# EAGLE design H08R7 (EAGLE 9.6.1)

## Sheet 1 of 2
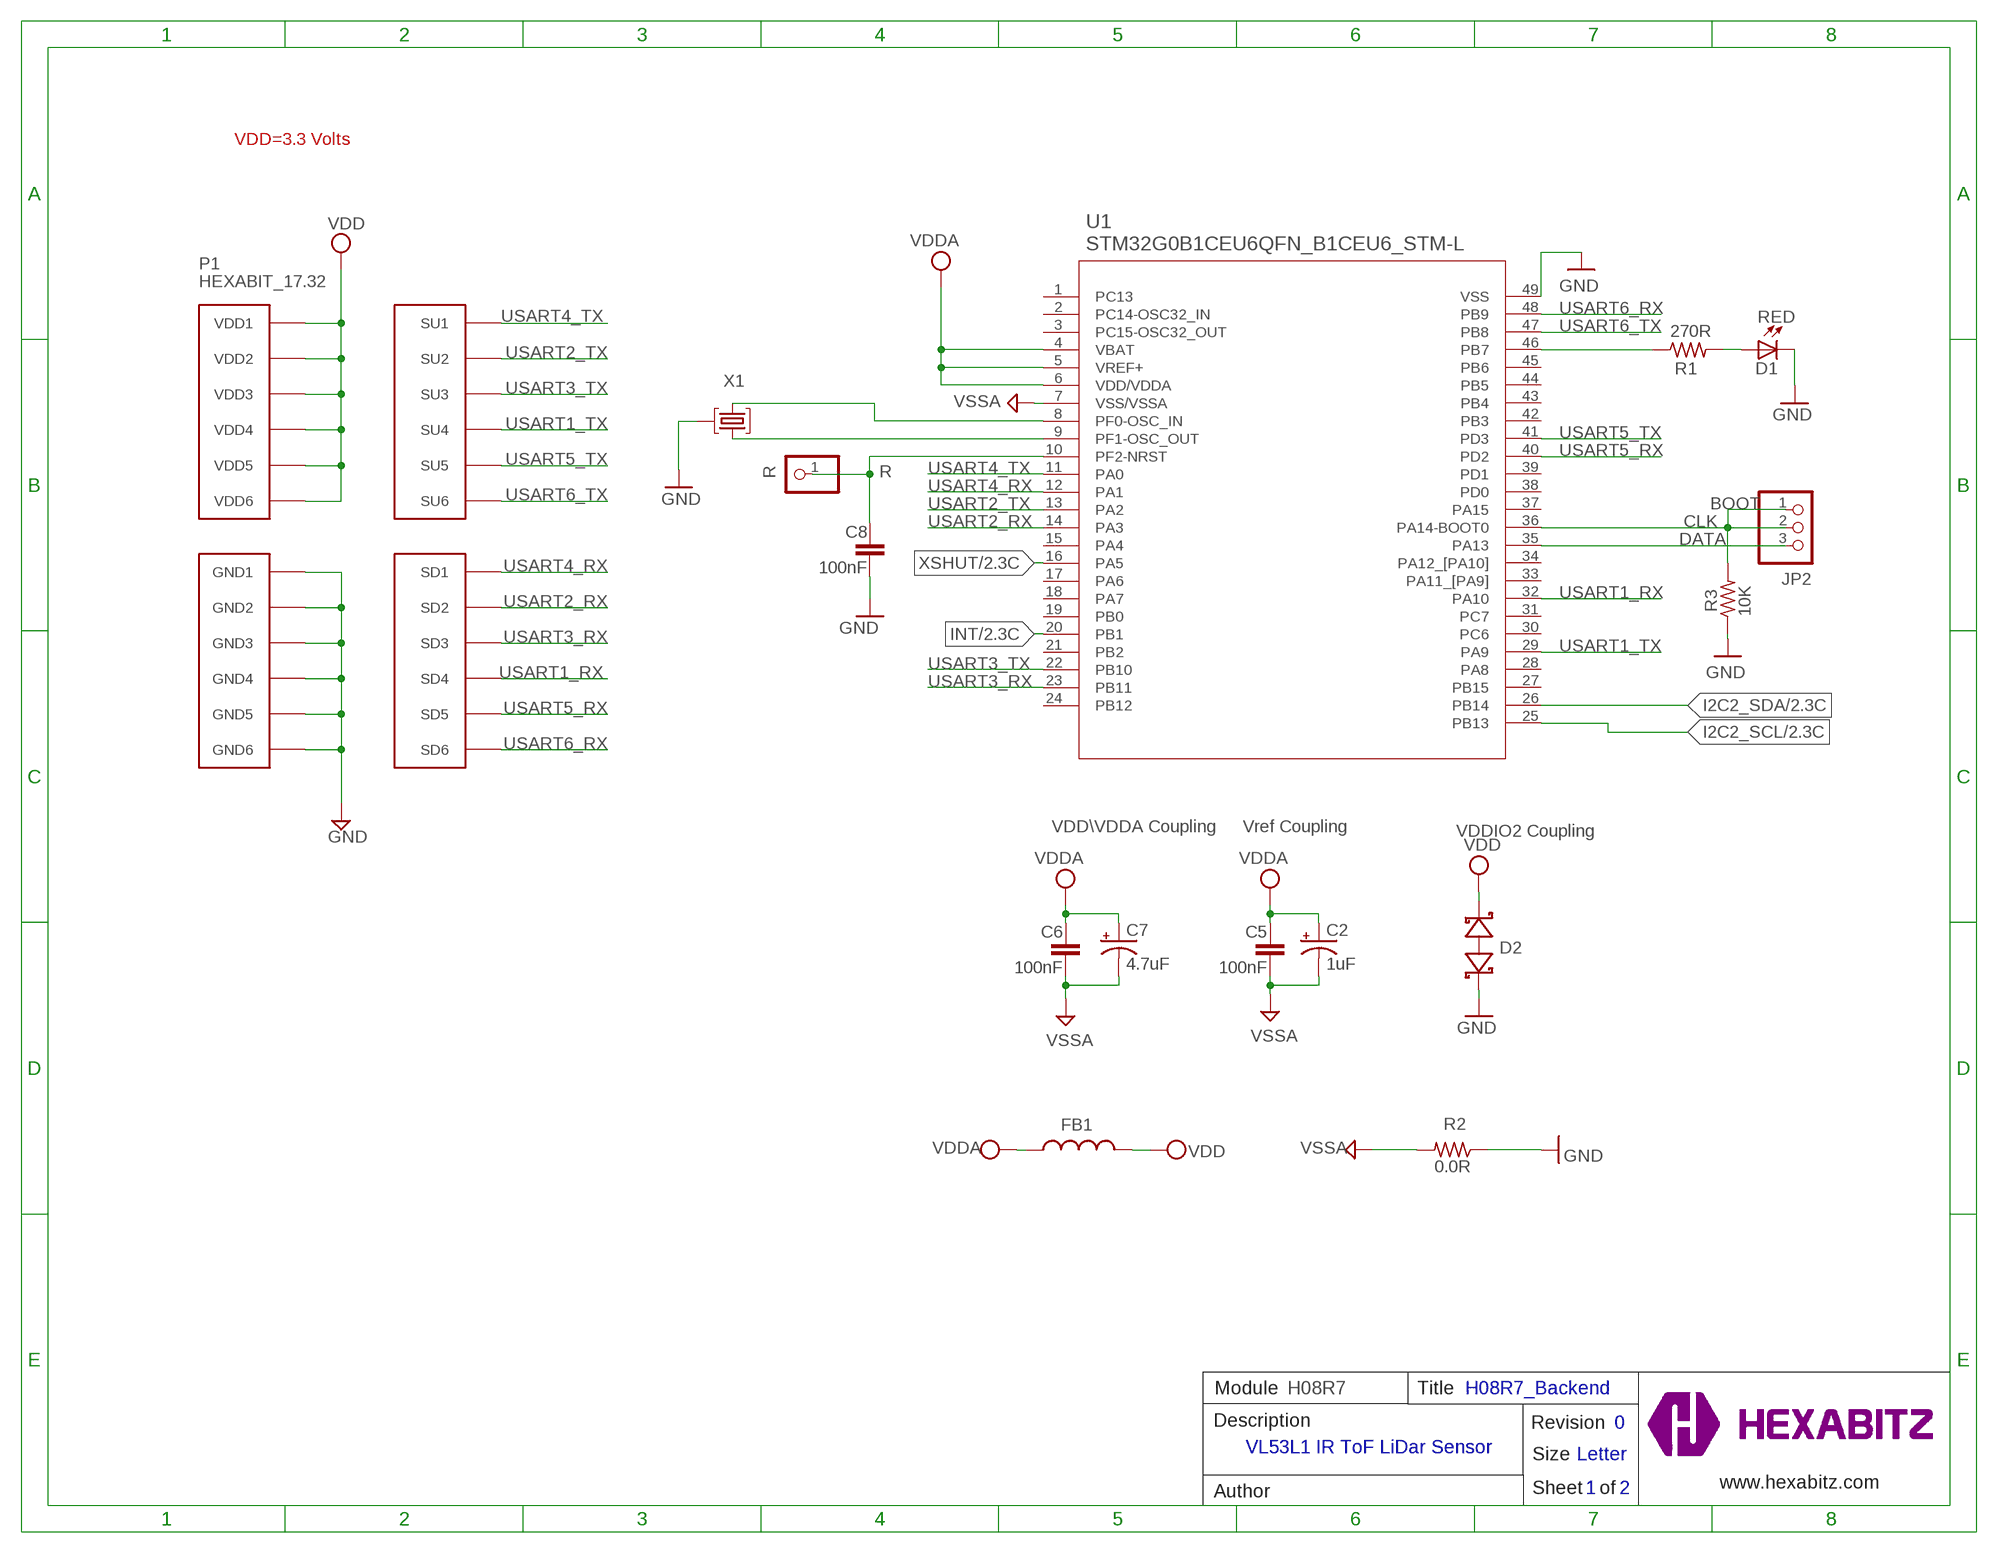
[diagram p0: schematic, sheet 1]

### Parts
C2  1uF  C-0805-POL  [C-0805-POL]
C5  100nF  C-0603  [C-0603]
C6  100nF  C-0603  [C-0603]
C7  4.7uF  C-0805-POL  [C-0805-POL]
C8  100nF  C-0603  [C-0603]
D1  RED  VLMS1300-GS08  [VLMS1300-GS08]
D2  BOURNS_CDSOD323-T03SCBOURNS_CDSOD323-T03SC_0_0  [BOURNS_CDSOD323-T03SC_0]
FB1  FB-TDK_MMZ1608Y300B  [FB-TDK_MMZ1608Y300B]
JP2  PINHD-1X3  [1X03]
P1  HEXABIT_17.32  [HEXABIT_17.32]
R  R  PINHD-1X1  [1X01]
R1  270R  R-0603  [R-0603]
R2  0.0R  R-0603  [R-0603]
R3  10K  R-0603  [R-0603]
TRIMBLE-LOGO1  HEXA-LOGO  [HEXA-LOGO]
U1  STM32G0B1CEU6QFN_B1CEU6_STM-L  [QFN_B1CEU6_STM-L]
X1  XTALL_CSTCE8M00G52  [XTALL_CSTCE8M00G52]

### Nets
CLK: JP2.1 JP2.2 R3.2 U1.36(PA14-BOOT0)
DATA: JP2.3 U1.35(PA13)
GND: C8.2 D1.C D2.1(A) P1.PAD_PD7(GND1) P1.PAD_PD8(GND2) P1.PAD_PD9(GND3) P1.PAD_PD10(GND4) P1.PAD_PD11(GND5) P1.PAD_PD12(GND6) R2.1 R3.1 U1.49(VSS) X1.P$2 ; also sheet 2
I2C2_SCL: U1.25(PB13) ; also sheet 2
I2C2_SDA: U1.26(PB14) ; also sheet 2
INT: U1.20(PB1) ; also sheet 2
N$3: D1.A R1.2
N$4: C8.1 R.1 U1.10(PF2-NRST)
N$5: U1.9(PF1-OSC_OUT) X1.P$1
N$6: U1.8(PF0-OSC_IN) X1.P$3
N$7: R1.1 U1.46(PB7)
USART1_RX: P1.PAD_PD4(SD4) U1.32(PA10)
USART1_TX: P1.PAD_PU4(SU4) U1.29(PA9)
USART2_RX: P1.PAD_PD2(SD2) U1.14(PA3)
USART2_TX: P1.PAD_PU2(SU2) U1.13(PA2)
USART3_RX: P1.PAD_PD3(SD3) U1.23(PB11)
USART3_TX: P1.PAD_PU3(SU3) U1.22(PB10)
USART4_RX: P1.PAD_PD1(SD1) U1.12(PA1)
USART4_TX: P1.PAD_PU1(SU1) U1.11(PA0)
USART5_RX: P1.PAD_PD5(SD5) U1.40(PD2)
USART5_TX: P1.PAD_PU5(SU5) U1.41(PD3)
USART6_RX: P1.PAD_PD6(SD6) U1.48(PB9)
USART6_TX: P1.PAD_PU6(SU6) U1.47(PB8)
VDD: D2.2(C) FB1.2 P1.PAD_PU7(VDD1) P1.PAD_PU8(VDD2) P1.PAD_PU9(VDD3) P1.PAD_PU10(VDD4) P1.PAD_PU11(VDD5) P1.PAD_PU12(VDD6) ; also sheet 2
VDDA: C2.1(+) C5.1 C6.1 C7.1(+) FB1.1 U1.4(VBAT) U1.5(VREF+) U1.6(VDD/VDDA)
VSSA: C2.2(-) C5.2 C6.2 C7.2(-) R2.2 U1.7(VSS/VSSA)
XSHUT: U1.16(PA5) ; also sheet 2
Unconnected: U1.1(PC13) U1.2(PC14-OSC32_IN) U1.3(PC15-OSC32_OUT) U1.15(PA4) U1.17(PA6) U1.18(PA7) U1.19(PB0) U1.21(PB2) U1.24(PB12) U1.27(PB15) U1.28(PA8) U1.30(PC6) U1.31(PC7) U1.33(PA11_[PA9]) U1.34(PA12_[PA10]) U1.37(PA15) U1.38(PD0) U1.39(PD1) U1.42(PB3) U1.43(PB4) U1.44(PB5) U1.45(PB6)

### Notes on the sheet
- VDD=3.3 Volts
- BOOT
- VDD\VDDA Coupling | Vref Coupling | VDDIO2 Coupling
- Module | H08R7 | Title | H08R7_Backend
- Description | Revision | 0
- VL53L1 IR ToF LiDar Sensor
- Size | Letter
- www.hexabitz.com
- Author | Sheet   of | 1 | 2
- C:/Users/Admin/Desktop/logodraft.bmp

## Sheet 2 of 2
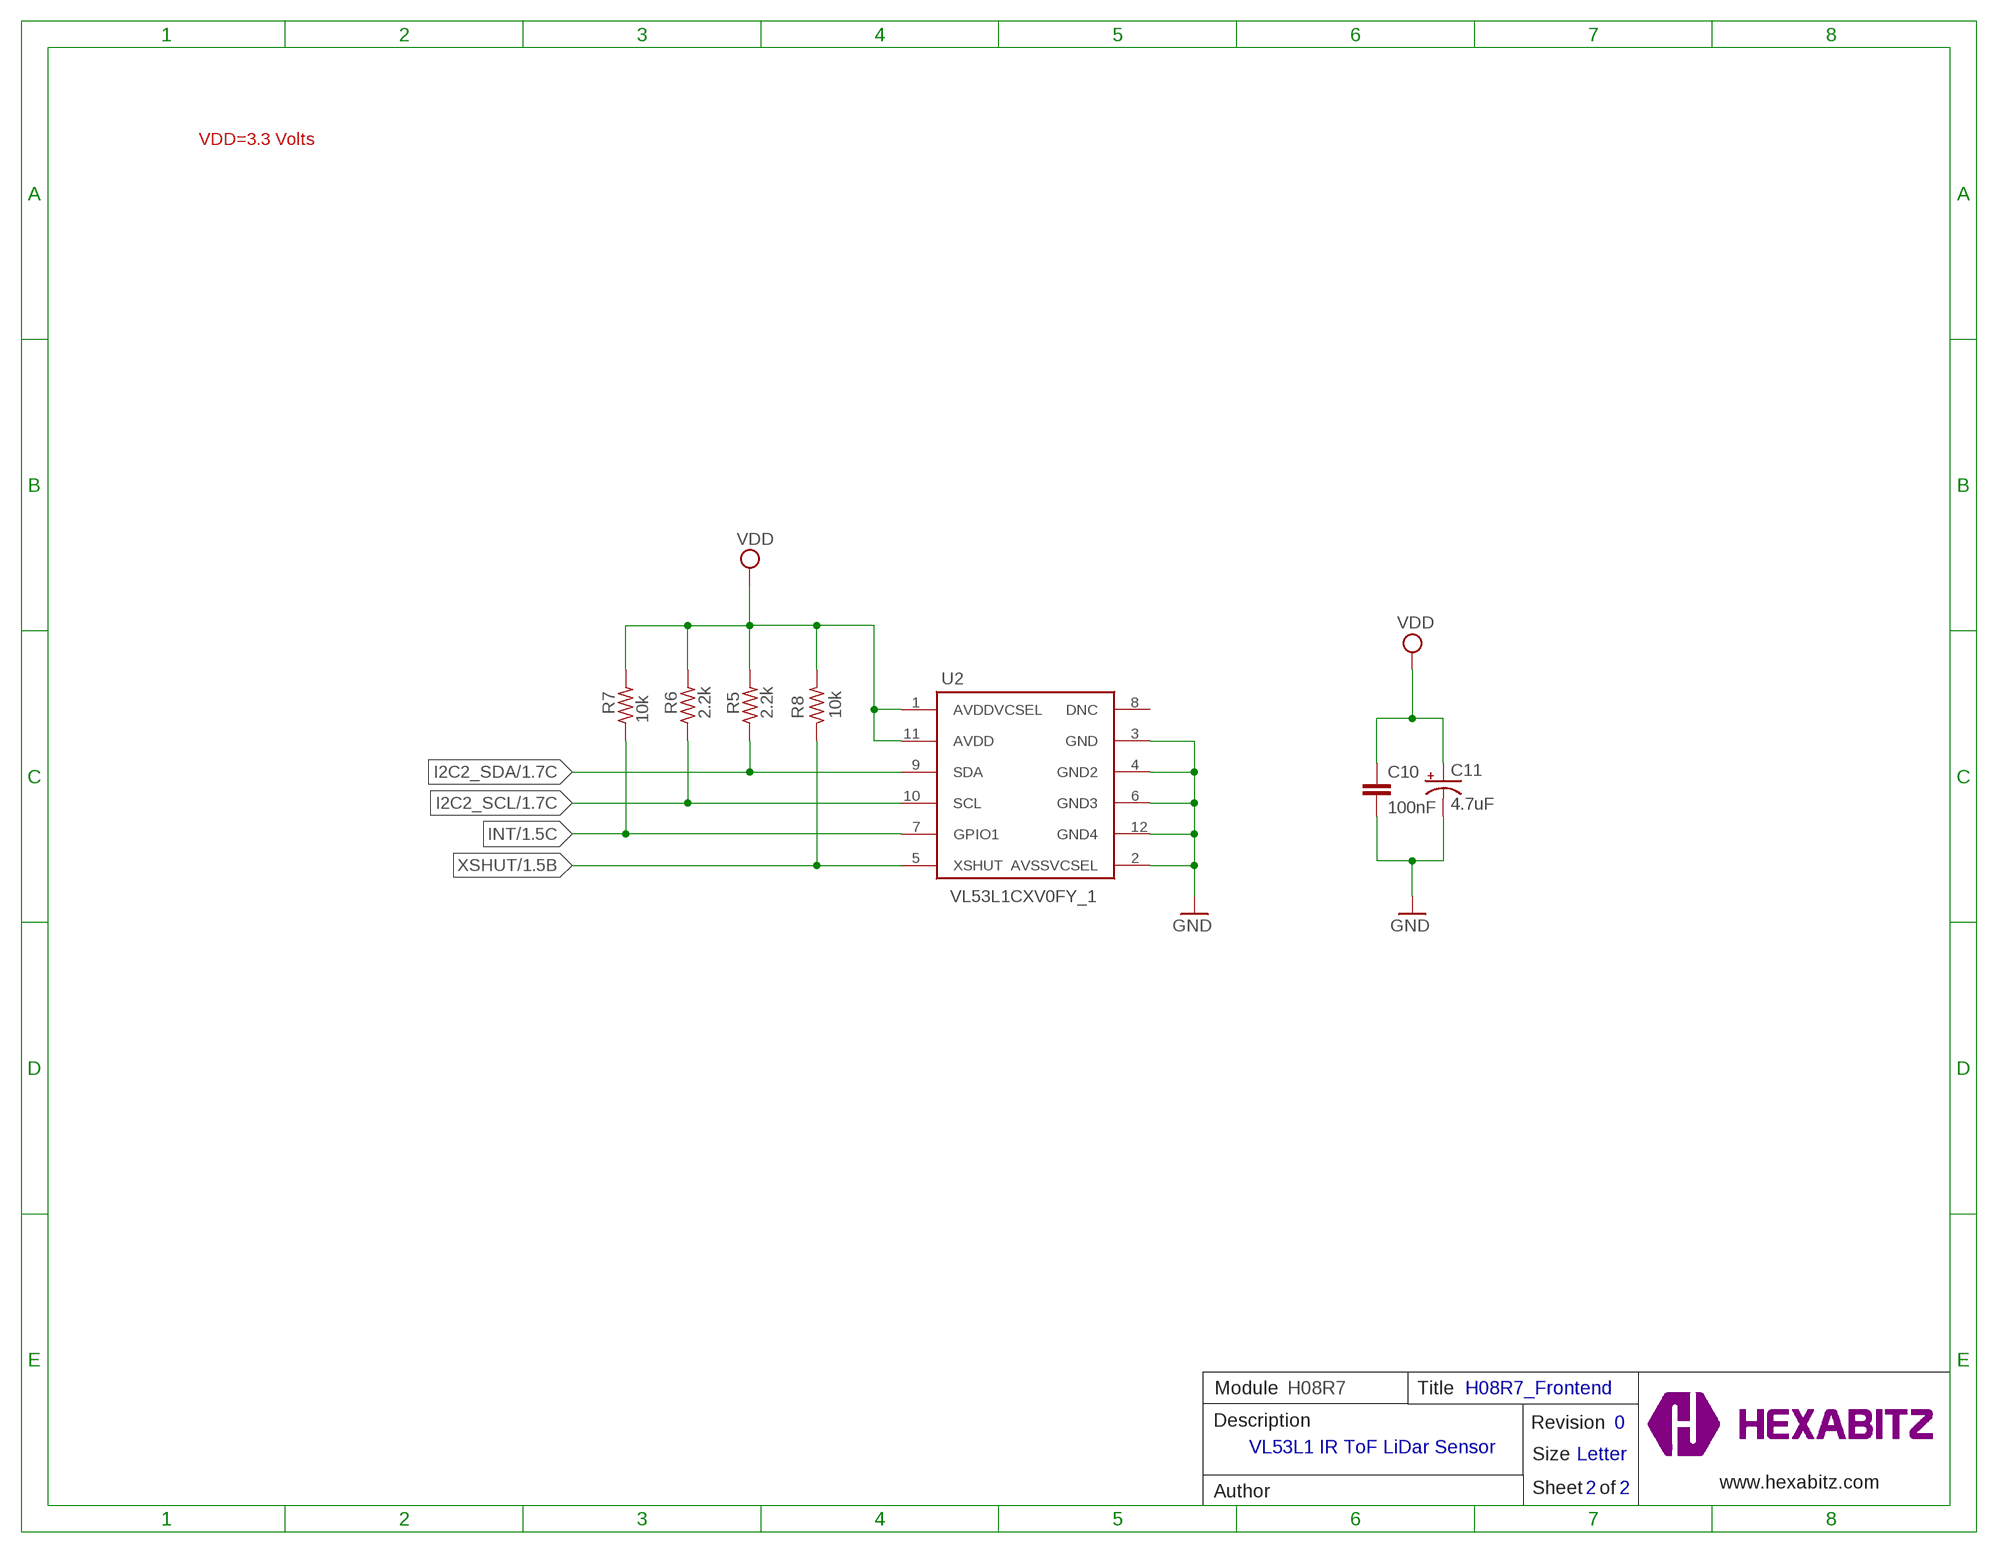
[diagram p1: schematic, sheet 2]

### Parts
C10  100nF  C-0603  [C-0603]
C11  4.7uF  C-0805-POL  [C-0805-POL]
R5  2.2k  R-0603  [R-0603]
R6  2.2k  R-0603  [R-0603]
R7  10k  R-0603  [R-0603]
R8  10k  R-0603  [R-0603]
U2  VL53L1CXV0FY_1  [VL53L1CXV0FY1]

### Nets
GND: C10.2 C11.2(-) U2.2(AVSSVCSEL) U2.3(GND) U2.4(GND2) U2.6(GND3) U2.12(GND4) ; also sheet 1
I2C2_SCL: R6.1 U2.10(SCL) ; also sheet 1
I2C2_SDA: R5.1 U2.9(SDA) ; also sheet 1
INT: R7.1 U2.7(GPIO1) ; also sheet 1
VDD: C10.1 C11.1(+) R5.2 R6.2 R7.2 R8.2 U2.1(AVDDVCSEL) U2.11(AVDD) ; also sheet 1
XSHUT: R8.1 U2.5(XSHUT) ; also sheet 1
Unconnected: U2.8(DNC)

### Notes on the sheet
- VDD=3.3 Volts
- Module | H08R7 | Title | H08R7_Frontend
- Description | Revision | 0
- VL53L1 IR ToF LiDar Sensor
- Size | Letter
- www.hexabitz.com
- Author | Sheet   of | 2 | 2

## Library data of the parts
C2 C7 C11 = HEXABITZ_RCLS:C-0805-POL: Cap Tant Solid SMD 2012
C5 C6 C8 C10 = HEXABITZ_RCLS:C-0603: CAP CER 10% X7R 0603
D1 = Hexabitz:VLMS1300-GS08: Red 0603 130° Clear 54 mcd 2 V Surface Mount ChipLED ; Octopart Url : http://octopart.com/vlms1300-gs08-vishay-21709201; MFN: Vishay; MPN: VLMS1300-GS08; OCTOPART_URL: https://octopart.com/vlms1300-gs08-vishay-21709201?r=sp&s=_gcP4_q8T1SC6PJQPTQ9yA
D2 = HEXABITZ_RCLS:BOURNS_CDSOD323-T03SC: CDSOD323-TxxSC - TVS Diode Series; DESCRIPTION: Dio Tvs Vwm 03V 500W Bidir Sod323 / Tape & Reel - 7" Reel; MFN: Bourns; MPN: CDSOD323-T03SC; OCTOPART_URL: https://octopart.com/cdsod323-t03sc-bourns-10487153?r=sp
FB1 = HEXABITZ_RCLS:FB-TDK_MMZ1608Y300B: Ferrite Beads Multi-Layer 30Ohm 25% 100MHz 1.5A 50mOhm DCR 0603; MFN: TDK; MPN: MMZ1608Y300B; OCTOPART_URL: https://octopart.com/mmz1608y300b-tdk-368280?r=sp&s=cd9_2ZEqQ9q9UNBuQgHAiA
JP2 = pinhead:PINHD-1X3: PIN HEADER
P1 = hexabitz_connectors:HEXABIT_?: Hexabitz Hexagon Module Connector Hexagon side length = 28.87mm.
R = HEXABITZ_USER_INTERFACE_PARTS:PINHD-1X1: PIN HEADER; MFN: TE Connectivity; MPN: 87227-1; OCTOPART_URL: https://octopart.com/87227-1-te+connectivity-39512052?r=sp
R1 R3 R5-R8 = HEXABITZ_RCLS:R-0603: Thick Film Resistors - SMD 0603
R2 = HEXABITZ_RCLS:R-0603: Thick Film Resistors - SMD 0603; MFN: Yageo; MPN: RC0603JR-070RL; OCTOPART_URL: https://octopart.com/rc0603jr-070rl-yageo-1241539?r=sp&s=X2NteqRjRNWrnx42Y0aliA; RESISTANCE: 0.0 Ohm
TRIMBLE-LOGO1 = HEXABITZ_USER_INTERFACE_PARTS:HEXA-LOGO: Trimble-Logo
U1 = HEXABITZ_ICs:STM32G0B1CEU6; COPYRIGHT: Copyright (C) 2021 Ultra Librarian. All rights reserved.; MANUFACTURER_PART_NUMBER: STM32G0B1CEU6; MFR_NAME: STMicroelectronics
U2 = HEXABITZ_ICs:VL53L1CXV0FY_1: Long distance ranging Time-of-Flight sen Source: Datasheet <https://componentsearchengine.com/Datasheets/1/VL53L1CXV0FY_1.pdf>; DESCRIPTION: Long distance ranging Time-of-Flight sen; HEIGHT: 1mm; MANUFACTURER_NAME: STMicroelectronics; MANUFACTURER_PART_NUMBER: VL53L1CXV0FY/1; MOUSER_PART_NUMBER: 511-VL53L1CXV0FY/1; MOUSER_PRICE-STOCK: https://www.mouser.co.uk/ProductDetail/STMicroelectronics/VL53L1CXV0FY-1?qs=W0yvOO0ixfFQE5v5L6h6PA%3D%3D
X1 = Hexabitz:XTALL_CSTCE8M00G52: MURATA CSTCE8M00G52-R0 RESONATOR, SMD, 8MHZ ; Octopart Url : https://octopart.com/cstce8m00g52-r0-murata-7145559; MFN: Murata; MPN: CSTCE8M00G52Z-R0; OCTOPART_URL: https://octopart.com/cstce8m00g52z-r0-murata-17755941?r=sp&s=JDnNJnrHQhyS8Zk4ofFWXw

## Board
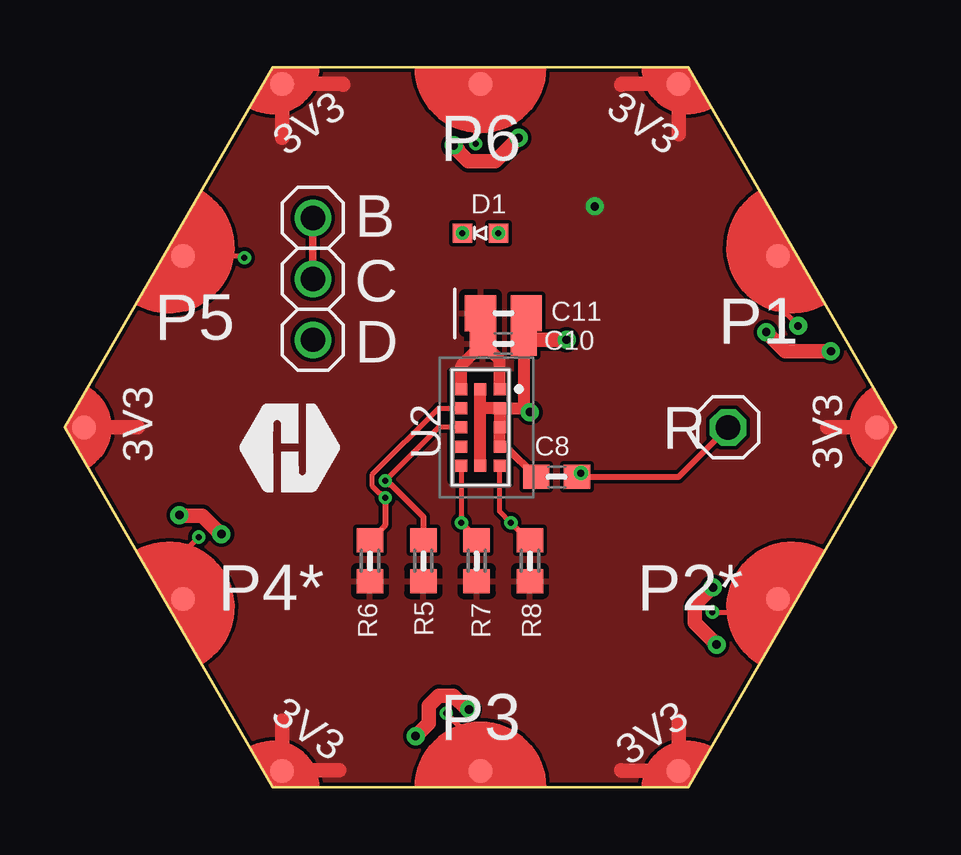
[diagram p2: board, top side]
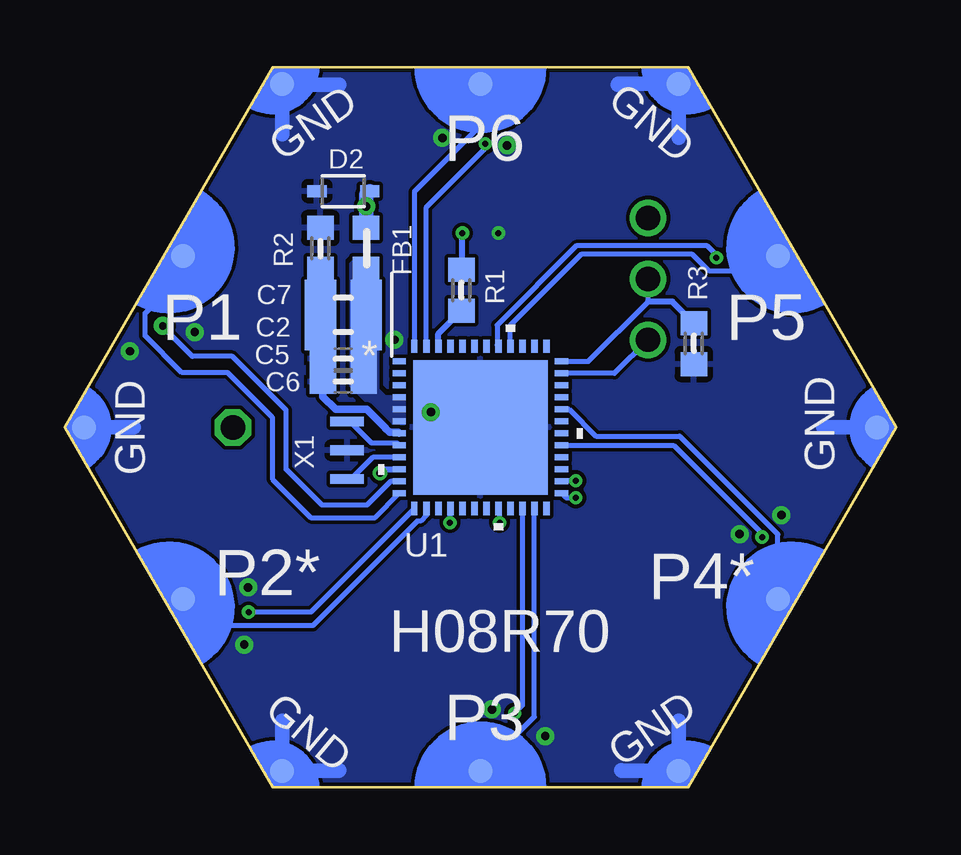
[diagram p3: board, bottom side, seen from below]

Size 34.64 x 30 mm. Coordinates in mm from the lower left corner, seen from the top.
Copper layers (1*16): Top 0.035mm / dielectric 1.5mm / Bottom 0.035mm
Design rules "default *": minimum track width 6mil, minimum drill 0.25mm, track to track 6mil, track to pad 6mil, pad to pad 6mil, via to via 6mil, smd to smd 0mil, copper to edge 0.15mm, drill to drill 1mil, minimum pad ring 10mil, minimum via ring 6mil, stop-mask expansion 4mil, vias tented up to drill 25mil, thermal gap 10mil

### Footprints (pad centres in the part's own frame; a part is rotated, then mirrored left to right if it is on the bottom)
C-0805-POL = smd 1.3 x 1.5: 1 -0.95,0; 2 0.95,0
C-0603 = smd 1.1 x 1: 1 -0.85,0; 2 0.85,0
VLMS1300-GS08 = smd 0.8 x 0.8: A 0,0.75; C 0,-0.75
BOURNS_CDSOD323-T03SC_0 = smd 0.8 x 0.5: 1 -1.1,0; 2 1.1,0
FB-TDK_MMZ1608Y300B = smd 1 x 1.1: 1 -0.85,0; 2 0.85,0
1X03 = drill 1.016: 1 -2.54,0; 2 0,0; 3 2.54,0
HEXABIT_17.32 = smd 1 x 1 bottom: PAD_PD1 12.39,7.15; PAD_PD2 12.39,-7.15; PAD_PD3 0,-14.31; PAD_PD4 -12.39,-7.15; PAD_PD5 -12.39,7.15; PAD_PD6 0,14.31; PAD_PD7 8.26,14.31; PAD_PD8 16.52,0; PAD_PD9 8.26,-14.31; PAD_PD10 -8.26,-14.31; PAD_PD11 -16.52,0; PAD_PD12 -8.26,14.31 | smd 1 x 1: PAD_PU1 12.39,7.15; PAD_PU2 12.39,-7.15; PAD_PU3 0,-14.31; PAD_PU4 -12.39,-7.15; PAD_PU5 -12.39,7.15; PAD_PU6 0,14.31; PAD_PU7 8.26,14.31; PAD_PU8 16.52,0; PAD_PU9 8.26,-14.31; PAD_PU10 -8.26,-14.31; PAD_PU11 -16.52,0; PAD_PU12 -8.26,14.31
1X01 = drill 1.016 octagon: 1 0,0
R-0603 = smd 1 x 1.1: 1 -0.85,0; 2 0.85,0
QFN_B1CEU6_STM-L = smd 0.55 x 0.254: 1 -3.38,2.751; 2 -3.38,2.251; 3 -3.38,1.75; 4 -3.38,1.25; 5 -3.38,0.75; 6 -3.38,0.25; 7 -3.38,-0.25; 8 -3.38,-0.75; 9 -3.38,-1.25; 10 -3.38,-1.75; 11 -3.38,-2.251; 12 -3.38,-2.751; 25 3.38,-2.751; 26 3.38,-2.251; 27 3.38,-1.75; 28 3.38,-1.25; 29 3.38,-0.75; 30 3.38,-0.25; 31 3.38,0.25; 32 3.38,0.75; 33 3.38,1.25; 34 3.38,1.75; 35 3.38,2.251; 36 3.38,2.751 | smd 0.254 x 0.55: 13 -2.751,-3.38; 14 -2.251,-3.38; 15 -1.75,-3.38; 16 -1.25,-3.38; 17 -0.75,-3.38; 18 -0.25,-3.38; 19 0.25,-3.38; 20 0.75,-3.38; 21 1.25,-3.38; 22 1.75,-3.38; 23 2.251,-3.38; 24 2.751,-3.38; 37 2.751,3.38; 38 2.251,3.38; 39 1.75,3.38; 40 1.25,3.38; 41 0.75,3.38; 42 0.25,3.38; 43 -0.25,3.38; 44 -0.75,3.38; 45 -1.25,3.38; 46 -1.75,3.38; 47 -2.251,3.38; 48 -2.751,3.38 | smd 5.6 x 5.6: 49 0,0
VL53L1CXV0FY1 = smd 0.5 x 0.5: 1 -1.6,0.8; 2 -0.8,0.8; 3 0,0.8; 4 0.8,0.8; 5 1.6,0.8; 6 1.6,0; 7 1.6,-0.8; 8 0.8,-0.8; 9 0,-0.8; 10 -0.8,-0.8; 11 -1.6,-0.8; 12 -1.6,0
XTALL_CSTCE8M00G52 = smd 1.4 x 0.4: P$1 0,1.2; P$2 0,0; P$3 0,-1.2

### Placement (x,y rotation side)
C2  23.04,18.97 180 bottom
C5  23.04,17.86 180 bottom
C6  23.04,16.91 180 bottom
C7  23.04,20.4 180 bottom
C8  20.5,12.94 180 top
C10  18.27,18.49 0 top
C11  18.27,19.76 0 top
D1  17.32,23.1 270 top
D2  23.04,24.84 0 bottom
FB1  22.08,22.46 90 bottom
JP2  10.34,21.19 270 top
P1  17.32,15 0 top
R  27.64,15 0 top
R1  18.11,20.72 90 bottom
R2  23.99,22.46 270 bottom
R3  8.43,18.49 90 bottom
R5  14.94,9.44 270 top
R6  12.72,9.44 270 top
R7  17.16,9.44 270 top
R8  19.38,9.44 270 top
TRIMBLE-LOGO1  9.38,12.3 0 top
U1  17.32,15 0 bottom
U2  17.32,15 270 top
X1  22.88,14.05 180 bottom

### Tracks (layer width: path | path; a pad name or v marks a point on that pad's centre or on a via)
CLK
  Top 0.305: JP2.1 JP2.2
  Bottom 0.203: U1.36 12.82,17.75 10.34,20.24 JP2.2
  Bottom 0.254: R3.2 9.33,20.24 10.34,20.24
DATA
  Bottom 0.203: JP2.3 11.74,17.25 U1.35
GND  (via drill 0.25 pad 0.55, 0.35 pad 0.75)
  Top 0.305: C8.2 18.38,14.2 U2.4
  Top 0.508: C10.2 19.12,15.9 v19.38,15.63 19.22,15.8 U2.2 | U2.6 17.32,15.79 | 17.32,15.79 U2.12 | U2.4 U2.3 U2.2 | U2.2 17.32,15.79
  Top 0.61: v4.78,11.35 4.8,11.33 5.73,11.33 6.5,10.55 v6.53,10.55 | v14.62,2.14 15.16,2.68 15.16,3.4 15.59,3.83 16.2,3.83 16.77,3.25 v16.84,3.25 | v27,8.33 26.97,8.33 26.25,7.61 26.25,6.87 v27.16,5.95 | v31.93,18.17 30.02,18.17 v29.23,18.97 | v16.21,26.75 16.39,26.57 16.39,26.52 16.82,26.09 17.93,26.09 v18.91,27.06 | C11.2 19.22,18.59 C10.2 19.28,18.65 v20.91,18.65
  Bottom 0.508: U1.49 18.75,15 v19.38,15.63
  Bottom 0.61: P1.PAD_PD11 3.03,15 | 11.45,0.71 11.42,0.69 P1.PAD_PD10 9.06,2.77 9.07,2.78 | 25.57,2.78 25.58,2.77 P1.PAD_PD9 23.22,0.69 23.19,0.71 | P1.PAD_PD8 31.77,15 | 25.57,27.22 25.58,27.23 P1.PAD_PD7 25.56,29.29 23.19,29.29 | 9.07,27.06 9.06,27.07 P1.PAD_PD12 11.58,29.31 11.6,29.29
  other vias: 16.57,23.1
  pour Bottom (rank 2): 0.17,14.74 8.62,29.88 26.04,29.88 34.58,14.87 26.08,0.08 8.75,0.08
I2C2_SCL  (via drill 0.25 pad 0.55)
  Top 0.203: v13.35,12.07 13.18,12.25 13.13,12.25 12.82,12.56 12.82,13.04 15.58,15.8 U2.10
  Top 0.254: v13.35,12.07 13.35,10.93 R6.1
  Bottom 0.203: U1.25 13.76,12.07 v13.35,12.07
I2C2_SDA  (via drill 0.25 pad 0.55)
  Top 0.203: U2.9 15.57,15 v13.35,12.78
  Top 0.254: v13.35,12.78 13.5,12.63 13.58,12.63 14.94,11.27 R5.1
  Bottom 0.203: v13.35,12.78 13.91,12.78 U1.26
INT  (via drill 0.25 pad 0.55)
  Top 0.203: U2.7 v16.53,11.03
  Top 0.254: v16.53,11.03 17.16,10.4 R7.1
  Bottom 0.203: v16.53,11.03 16.53,11.58 U1.20
N$3  (via drill 0.25 pad 0.55)
  Bottom 0.254: R1.2 18.07,21.61 D1.A
  other vias: 18.07,23.1
N$4  (via drill 0.3 pad 0.6)
  Top 0.254: v21.5,13.09 C8.1 25.57,12.94 R.1
  Bottom 0.254: v21.5,13.09 21.35,13.25 U1.10
N$5
  Bottom 0.203: X1.P$1 22.72,12.85 21.82,13.75 U1.9
N$6
  Bottom 0.203: U1.8 20.79,14.34 21.86,14.34 22.76,15.25 X1.P$3
N$7
  Bottom 0.254: U1.46 19.07,18.91 R1.1
USART1_RX
  Bottom 0.203: P1.PAD_PD4 4.93,10.55 9.02,14.64 12.51,14.64 13.62,15.75 U1.32
USART1_TX  (via drill 0.25 pad 0.55)
  Top 0.203: v5.58,10.43 4.93,9.78 P1.PAD_PU4
  Bottom 0.203: U1.29 9.27,14.25 5.58,10.57 5.58,10.55 v5.58,10.43
USART2_RX
  Bottom 0.203: U1.14 19.57,11.34 19.82,11.09 19.96,11.09 24.31,6.74 28.6,6.74 P1.PAD_PD2
USART2_TX  (via drill 0.25 pad 0.55)
  Top 0.203: v26.98,7.31 29.17,7.31 P1.PAD_PU2
  Bottom 0.203: U1.13 24.39,7.31 v26.98,7.31
USART3_RX
  Bottom 0.203: P1.PAD_PD3 15.07,2.94 U1.23
USART3_TX  (via drill 0.25 pad 0.55)
  Top 0.203: v15.89,3.09 17.32,1.66 P1.PAD_PU3
  Bottom 0.203: U1.22 15.57,3.41 v15.89,3.09
USART4_RX
  Bottom 0.203: U1.12 21.71,11.24 24.39,11.24 25.99,12.85 25.99,15.42 27.85,17.29 29.77,17.29 31.29,18.81 31.29,19.76 29.71,21.34 P1.PAD_PD1
USART4_TX  (via drill 0.3 pad 0.75)
  Top 0.203: v30.55,19.23 29.71,20.07 P1.PAD_PU1
  Bottom 0.203: U1.11 21.06,12.75 22.05,11.76 23.92,11.76 25.42,13.25 25.42,15.72 27.66,17.96 29.33,17.96 30.55,19.19 v30.55,19.23
USART5_RX
  Bottom 0.203: P1.PAD_PD5 5.57,21.51 7.79,21.51 8.49,22.21 13.13,22.21 16.07,19.27 U1.40
USART5_TX  (via drill 0.25 pad 0.55)
  Top 0.203: P1.PAD_PU5 7.41,22.15 v7.49,22.07
  Bottom 0.203: U1.41 16.63,18.44 16.63,19.26 13.33,22.56 7.86,22.56 7.49,22.19 v7.49,22.07
USART6_RX
  Bottom 0.203: P1.PAD_PD6 17.32,27.56 20.07,24.81 U1.48
USART6_TX  (via drill 0.25 pad 0.55)
  Top 0.203: v17.12,26.82 17.12,29.11 P1.PAD_PU6
  Bottom 0.203: U1.47 19.57,24.18 17.12,26.62 v17.12,26.82
VDD  (via drill 0.35 pad 0.75)
  Top 0.508: U2.11 16.52,17.59 C10.1 18.12,17.8 U2.1
  Top 0.61: P1.PAD_PU11 3.03,15 | 9.07,2.78 9.06,2.77 P1.PAD_PU10 9.08,0.71 11.45,0.71 | 25.57,2.78 P1.PAD_PU9 23.22,0.69 23.19,0.71 | P1.PAD_PU8 31.77,15 | 25.57,27.22 25.58,27.23 P1.PAD_PU7 23.22,29.31 23.19,29.29 | 9.07,27.06 P1.PAD_PU12 11.58,29.31 11.6,29.29
  Bottom 0.61: FB1.2 v22.08,24.21 22.08,24.7 D2.2
  pour Top (rank 2): 0.25,14.86 8.65,29.92 25.98,29.92 34.59,14.77 26,0.08 8.58,0.08
  cutout Top: 16.05,17.38 18.43,17.38 18.59,17.22 18.59,12.62 16.21,12.62 16.05,12.78
VDDA
  pour Bottom (no thermals): 20.5,16.27 21.29,16.27 21.61,16.59 21.61,21.98 22.56,21.98 22.72,21.83 22.72,21.19 22.72,16.75 21.13,15.16 20.5,15.16
VSSA
  Bottom 0.254: C2.2 23.98,17.96 C5.2
  Bottom 0.305: U1.7 20.75,14.8 21.1,14.8 21.28,14.98 22.05,15.75 23.35,15.75 23.88,16.29 C6.2
  pour Bottom: 24.46,21.98 24.46,16.59 24.31,16.43 23.51,16.43 23.51,21.98
XSHUT  (via drill 0.25 pad 0.55)
  Top 0.203: v18.59,11.03 18.12,11.5 U2.5
  Top 0.254: v18.59,11.03 19.33,10.29 R8.1
  Bottom 0.203: U1.16 18.59,11.6 v18.59,11.03

### Text on the board
tPlace: 3V3 | P6 | 3V3 | P5 | P1 | 3V3 | 3V3 | P4* | P2* | P3 | 3V3 | 3V3
bPlace: GND | P6 | GND | P5 | P1 | GND | GND | P2* | P4* | H08R70 | P3 | GND | GND
tNames: B | C | D
bNames: U1